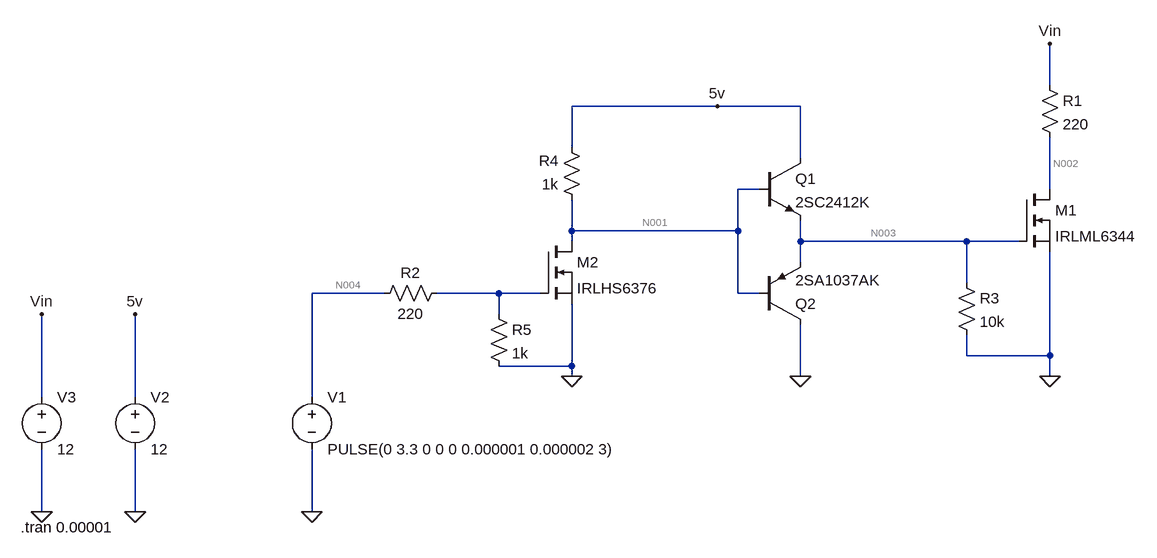
[diagram p0: schematic gate_driver_better.asc]
gate_driver_better.asc, the LTspice schematic file:
Version 4
SHEET 1 948 680
WIRE 640 -192 640 -256
WIRE 128 -160 -96 -160
WIRE 256 -160 128 -160
WIRE -96 -96 -96 -160
WIRE 256 -80 256 -160
WIRE 192 -32 160 -32
WIRE 640 -32 640 -112
WIRE -96 32 -96 -16
WIRE 160 32 160 -32
WIRE 160 32 -96 32
WIRE -96 48 -96 32
WIRE 256 48 256 16
WIRE 512 48 256 48
WIRE 592 48 512 48
WIRE 256 80 256 48
WIRE 512 112 512 48
WIRE -384 128 -496 128
WIRE -208 128 -304 128
WIRE -144 128 -208 128
WIRE 160 128 160 32
WIRE 192 128 160 128
WIRE -208 160 -208 128
WIRE 512 224 512 192
WIRE 640 224 640 64
WIRE 640 224 512 224
WIRE -96 240 -96 144
WIRE -96 240 -208 240
WIRE -96 256 -96 240
WIRE 256 256 256 176
WIRE 640 256 640 224
WIRE -912 288 -912 160
WIRE -768 288 -768 160
WIRE -496 288 -496 128
WIRE -912 464 -912 368
WIRE -768 464 -768 368
WIRE -496 464 -496 368
FLAG 640 256 0
FLAG 256 256 0
FLAG -912 464 0
FLAG -768 464 0
FLAG -496 464 0
FLAG -912 160 Vin
FLAG -768 160 5v
FLAG 640 -256 Vin
FLAG 128 -160 5v
FLAG -96 256 0
SYMBOL npn 192 -80 R0
SYMATTR InstName Q1
SYMATTR Value 2SC2412K
SYMBOL pnp 192 176 M180
SYMATTR InstName Q2
SYMATTR Value 2SA1037AK
SYMBOL voltage -496 272 R0
WINDOW 123 0 0 Left 0
WINDOW 39 0 0 Left 0
SYMATTR InstName V1
SYMATTR Value PULSE(0 3.3 0 0 0 0.000001 0.000002 3)
SYMBOL voltage -768 272 R0
WINDOW 123 0 0 Left 0
WINDOW 39 0 0 Left 0
SYMATTR InstName V2
SYMATTR Value 12
SYMBOL voltage -912 272 R0
WINDOW 123 0 0 Left 0
WINDOW 39 0 0 Left 0
SYMATTR InstName V3
SYMATTR Value 12
SYMBOL res 624 -208 R0
SYMATTR InstName R1
SYMATTR Value 220
SYMBOL nmos 592 -32 R0
SYMATTR InstName M1
SYMATTR Value IRLML6344
SYMBOL res 496 96 R0
SYMATTR InstName R3
SYMATTR Value 10k
SYMBOL res -288 112 R90
WINDOW 0 0 56 VBottom 2
WINDOW 3 32 56 VTop 2
SYMATTR InstName R2
SYMATTR Value 220
SYMBOL nmos -144 48 R0
SYMATTR InstName M2
SYMATTR Value IRLHS6376
SYMBOL res -80 0 R180
WINDOW 0 36 76 Left 2
WINDOW 3 36 40 Left 2
SYMATTR InstName R4
SYMATTR Value 1k
SYMBOL res -224 144 R0
SYMATTR InstName R5
SYMATTR Value 1k
TEXT -944 488 Left 2 !.tran 0.00001

The netlist it stands for:
* gate_driver_better.asc
Q1 5v N001 N003 0 2SC2412K
Q2 0 N001 N003 0 2SA1037AK
V1 N004 0 PULSE(0 3.3 0 0 0 0.000001 0.000002 3)
V2 5v 0 12
V3 Vin 0 12
R1 Vin N002 220
M1 N002 N003 0 0 IRLML6344
R3 N003 0 10k
R2 N005 N004 220
M2 N001 N005 0 0 IRLHS6376
R4 N001 5v 1k
R5 N005 0 1k
.model NPN NPN
.model PNP PNP
.lib standard.bjt
.model NMOS NMOS
.model PMOS PMOS
.lib standard.mos
.tran 0.00001
.backanno
.end

* Results of the author's LTspice run, read from the files saved beside the schematic
* Operating Point, zero values left out:
*   V(5v) = 12 V
*   V(n001) = 12 V
*   V(n003) = 11.39 V
*   V(vin) = 12 V
*   V(n002) = 841.1 µV
*   Ic(Q1) = 1.135 mA
*   Ib(Q1) = 4.144 µA
*   Ie(Q1) = -1.139 mA
*   Ic(Q2) = -282.8 pA
*   Ib(Q2) = 283.5 pA
*   Id(M1) = 54.54 mA
*   Is(M1) = -54.54 mA
*   Id(M2) = 818.3 pA
*   Is(M2) = -818.3 pA
*   I(R1) = 54.54 mA
*   I(R3) = 1.139 mA
*   I(R4) = -4.145 µA
*   I(V2) = -1.139 mA
*   I(V3) = -54.54 mA
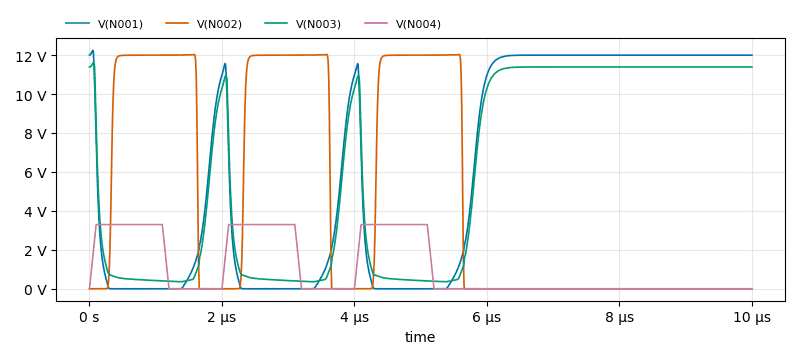
[diagram p1: Transient Analysis of gate_driver_better.asc, plotted from the saved traces]
* Transient Analysis, 1 run:
*   V(N001): min 200.2 µV, max 12.24 V, average 6.002 V, rms 8.19 V, last 12 V
*   V(N002): min 291.8 µV, max 12.04 V, average 4.676 V, rms 7.424 V, last 841.1 µV
*   V(N003): min 362.2 mV, max 11.6 V, average 5.853 V, rms 7.78 V, last 11.39 V
*   V(N004): min 0 V, max 3.3 V, average 1.089 V, rms 1.867 V, last 0 V